# EAGLE design ACCUM-SIGNAL (EAGLE 9.4.0)
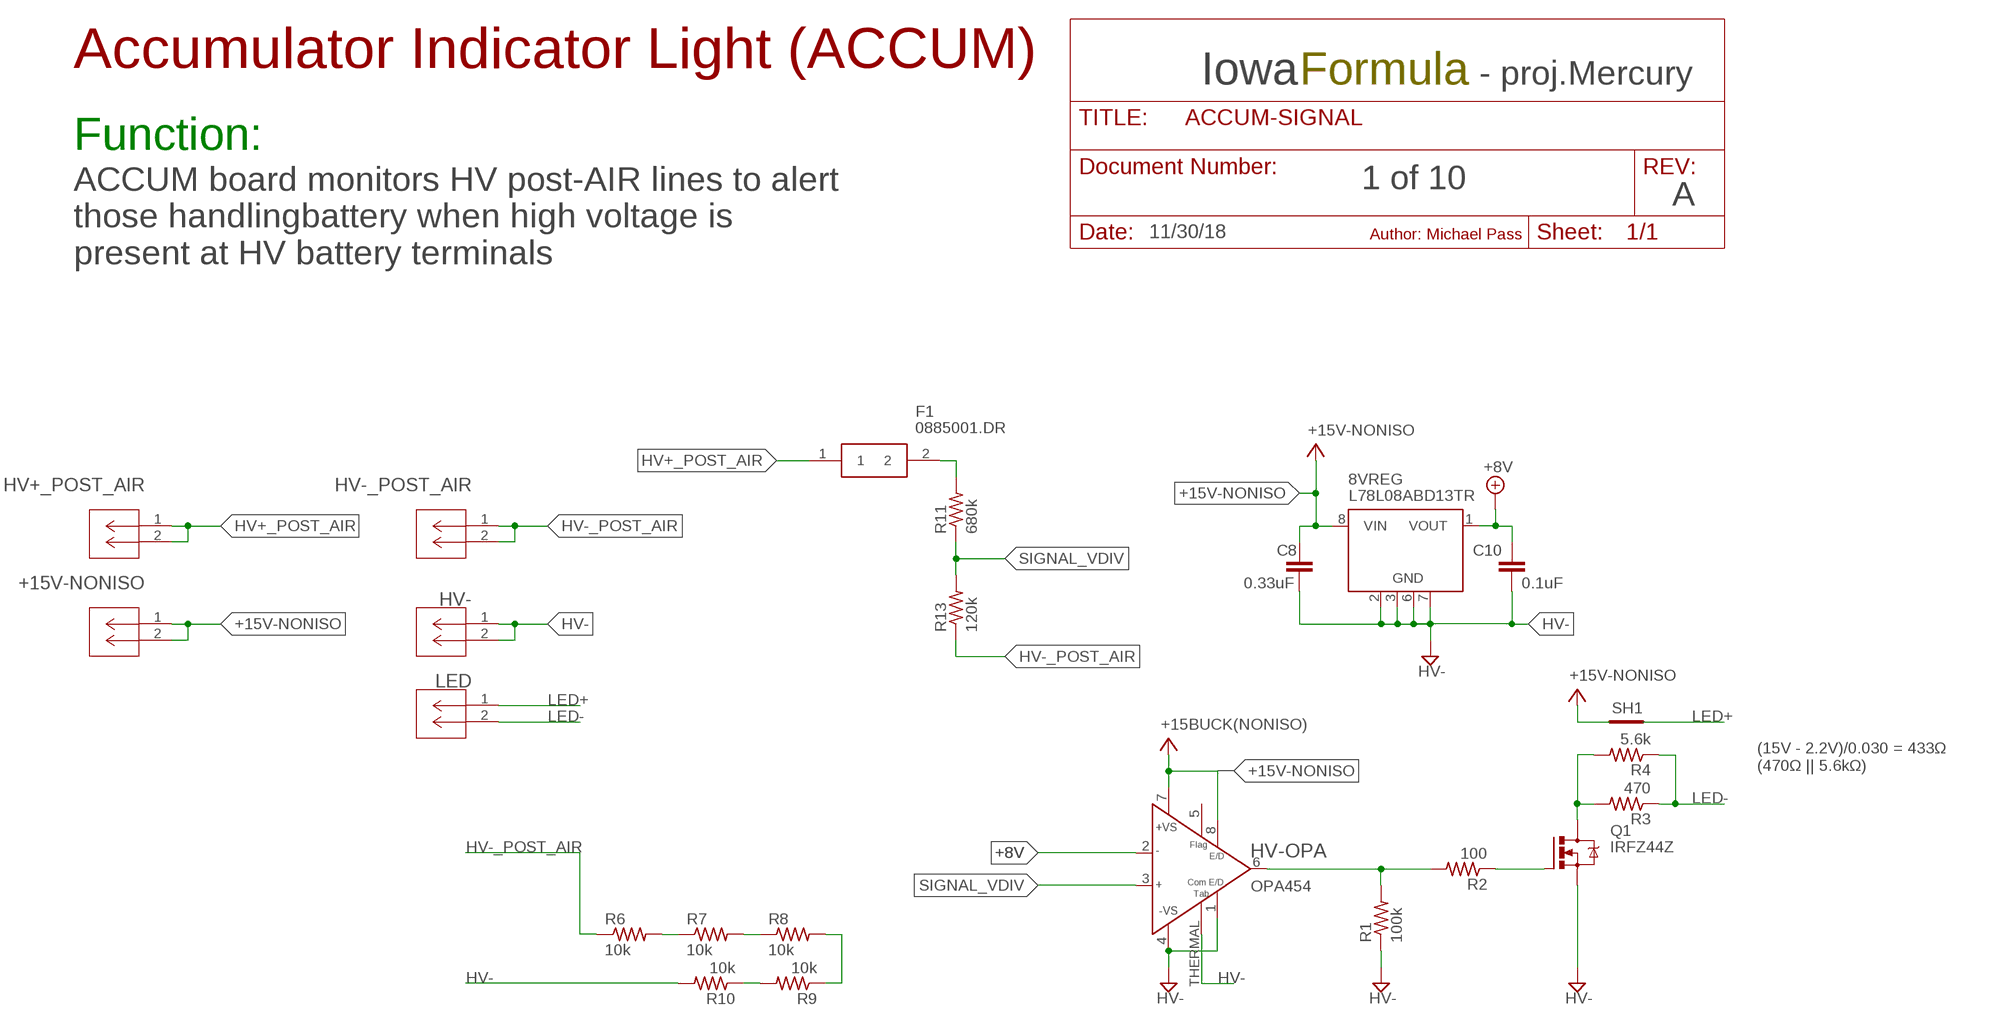
[diagram p0: schematic, sheet 1]

## Parts
8VREG  L78L08ABD13TR  78L08SMD  [SO08]
+15V-NONISO  2P(90DEG)_1-770966-0  [CON2_1X2_P163_RAMNL]
C8  0.33uF  C-EUC0805  [C0805]
C10  0.1uF  C-EUC0805  [C0805]
F1  0885001.DR  [FUSC10948X488N]
HV+_POST_AIR  2P(90DEG)_1-770966-0  [CON2_1X2_P163_RAMNL]
HV-  2P(90DEG)_1-770966-0  [CON2_1X2_P163_RAMNL]
HV-_POST_AIR  2P(90DEG)_1-770966-0  [CON2_1X2_P163_RAMNL]
HV-OPA  OPA454  [SO08GP]
LED  2P(90DEG)_1-770966-0  [CON2_1X2_P163_RAMNL]
Q1  IRFZ44Z  IRLZ44Z  [TO220BH]
R1  100k  R-US_R0805  [R0805]
R2  100  R-US_R0805  [R0805]
R3  470  R-US_R0805  [R0805]
R4  5.6k  R-US_R0805  [R0805]
R6  10k  R-US_R0805  [R0805]
R7  10k  R-US_R0805  [R0805]
R8  10k  R-US_R0805  [R0805]
R9  10k  R-US_R0805  [R0805]
R10  10k  R-US_R0805  [R0805]
R11  680k  R-US_R0805  [R0805]
R13  120k  R-US_R0805  [R0805]
SH1  SHORTT5  [SHORT_TOP-50]

## Nets
+8V: 8VREG.1(VOUT) C10.1 HV-OPA.2(IN-)
+15V-NONISO: 8VREG.8(VIN) +15V-NONISO.1 +15V-NONISO.2 C8.1 HV-OPA.7(+VS) HV-OPA.8(E/D) SH1.1 ; supply symbol labelled +15BUCK(NONISO)
HV+_POST_AIR: F1.1 HV+_POST_AIR.1 HV+_POST_AIR.2
HV-: 8VREG.2(GND) 8VREG.3(GND) 8VREG.6(GND) 8VREG.7(GND) C8.2 C10.2 HV-.1 HV-.2 HV-OPA.1(E/DCOM) HV-OPA.4(-VS) HV-OPA.THERMAL(E/DCOM1) Q1.S R1.1 R10.2
HV-_POST_AIR: HV-_POST_AIR.1 HV-_POST_AIR.2 R6.1 R13.1
LED+: LED.1 SH1.2
LED-: LED.2 R3.1 R4.1
N$1: Q1.D R3.2 R4.2
N$2: F1.2 R11.2
N$3: Q1.G R2.1
N$4: R7.2 R8.1
N$5: R6.2 R7.1
N$7: R8.2 R9.1
N$8: R9.2 R10.1
N$9: HV-OPA.6(OUT) R1.2 R2.2
SIGNAL_VDIV: HV-OPA.3(IN+) R11.1 R13.2
Unconnected: 8VREG.4(NC) 8VREG.5(NC) HV-OPA.5(STATUS)

## Notes on the sheet
- Accumulator Indicator Light (ACCUM)
- Iowa | Formula | - proj.Mercury
- Function:
- 1 of 10
- A
- 11/30/18 | Author: Michael Pass
- ACCUM board monitors HV post-AIR lines to alert
  those handlingbattery when high voltage is 
  present at HV battery terminals
- (15V - 2.2V)/0.030 = 433Ω
  (470Ω || 5.6kΩ)

## Library data of the parts
8VREG = linear:78L*SMD: Positive VOLTAGE REGULATOR
+15V-NONISO HV+_POST_AIR HV- HV-_POST_AIR LED = con-MATE-N-LOK:2P(90DEG)_1-770966-0; MANUFACTURER_PART_NUMBER: 17709660; VENDOR: TE Connectivity
C8 C10 = rcl:C-EU: CAPACITOR, European symbol; SPICEPREFIX: C
F1 = 0885001.DR:0885001.DR: LITTELFUSE - 0885001.DR - FUSE, AEC-Q200, 1A, 500VDC, 0402 Source: Datasheet <https://m.littelfuse.com/~/media/electronics/datasheets/fuses/littelfuse_fuse_885_datasheet.pdf.pdf>; DESCRIPTION: LITTELFUSE - 0885001.DR - FUSE, AEC-Q200, 1A, 500VDC, 0402; HEIGHT: 4.88mm; MANUFACTURER_NAME: LITTELFUSE; MANUFACTURER_PART_NUMBER: 0885001.DR; MOUSER_PART_NUMBER: 576-0885001.DR; MOUSER_PRICE-STOCK: https://www.mouser.com/Search/Refine.aspx?Keyword=576-0885001.DR
HV-OPA = OPA454:OPA454: TexasInstruments High-Voltage (100V), High-Current (50mA) Operatioanl Amplifier, G = 1 Stable http://focus.ti.com/lit/ds/symlink/opa454.pdf; AVAILABILITY: Unavailable; DESCRIPTION: High Voltage _100V_ High-Current _50mA_ Operational Amplifiers G=1 Stable; MF: Texas Instruments; MP: OPA454; PACKAGE: None; PRICE: None
Q1 = transistor-power:IRLZ44Z: N-Channel HEXFET® Power MOSFET Logic Level AUTOMOTIVE MOSFET Source: http://www.irf.com/product-info/datasheets/data/irlz44zpbf.pdf
R1-R4 R6-R11 R13 = rcl:R-US_: RESISTOR, American symbol; SPICEPREFIX: R
SH1 = shorts:SHORT: Short between two nets; BOM: no

## Board
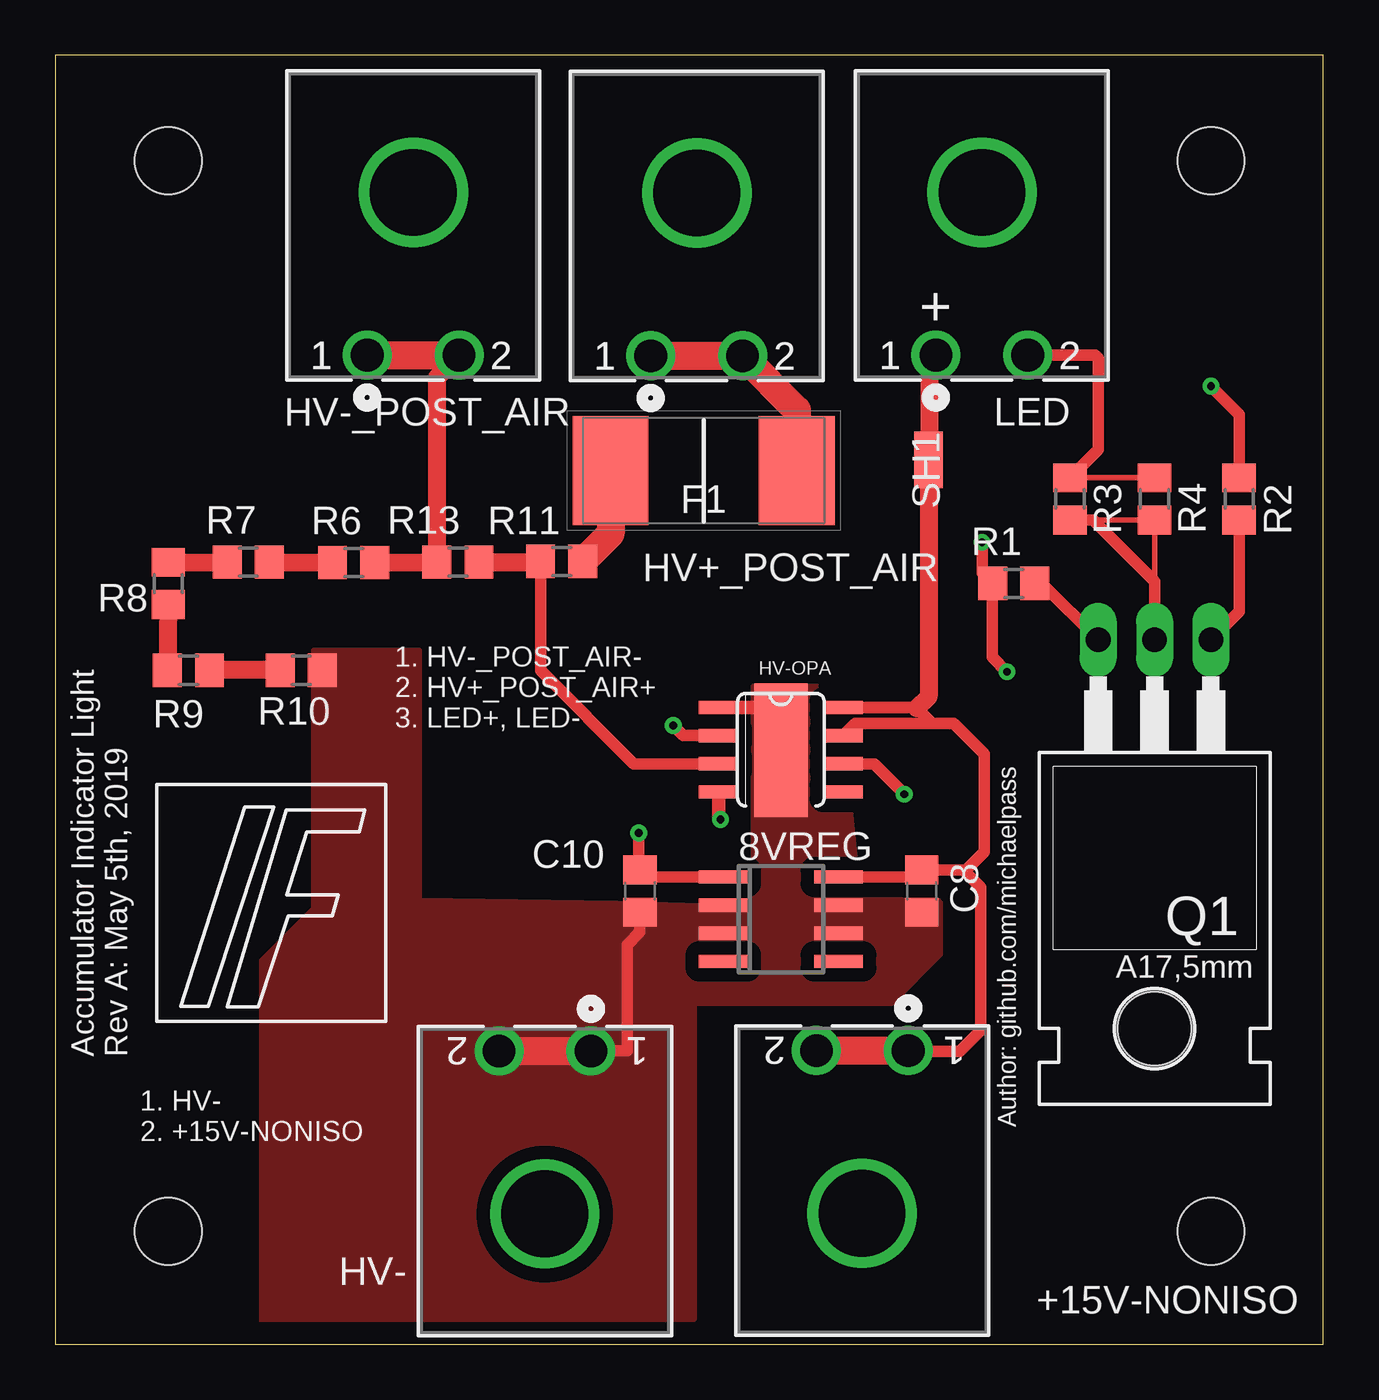
[diagram p1: board, top side]
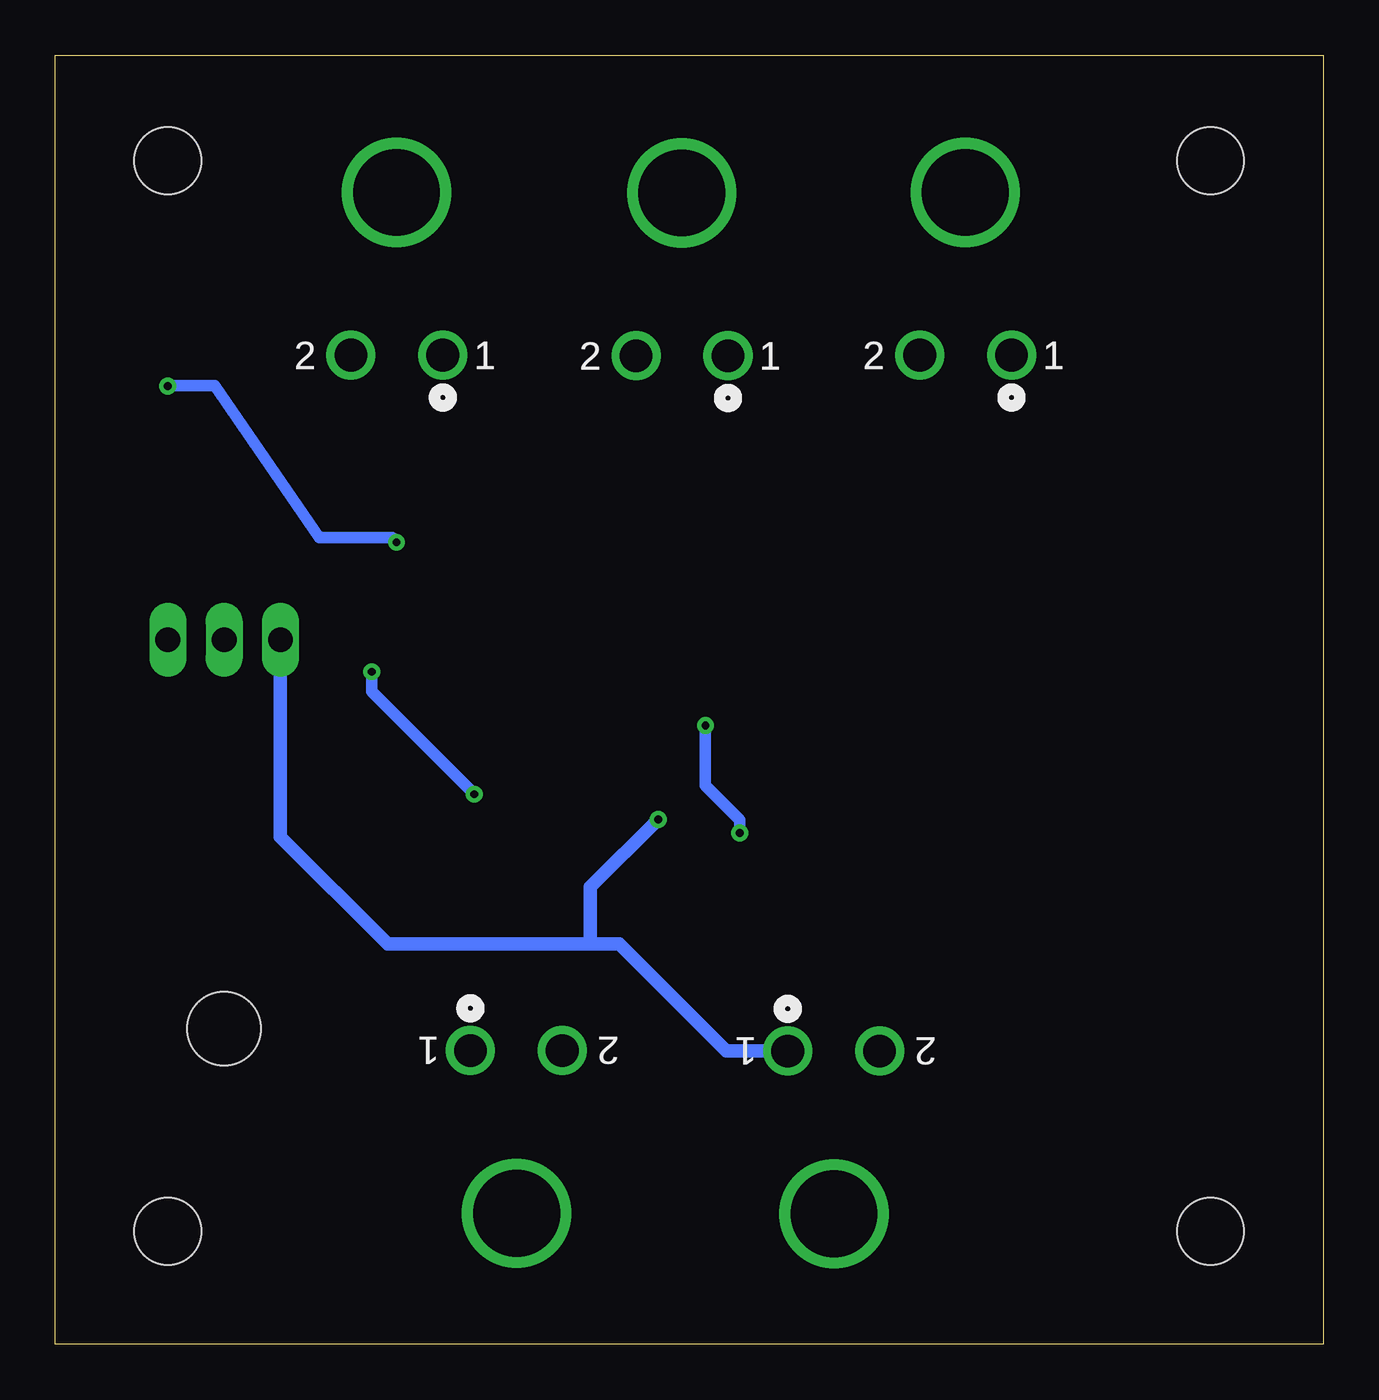
[diagram p2: board, bottom side, seen from below]

Size 57.13 x 58.09 mm. Coordinates in mm from the lower left corner, seen from the top.
Outline: 0,0 57.13,0 57.13,58.09 0,58.09 0,0
Copper layers (1*16): Top 0.035mm / dielectric 1.5mm / Bottom 0.035mm
Design rules "default": minimum track width 6mil, minimum drill 0.35mm, track to track 6mil, track to pad 6mil, pad to pad 6mil, via to via 6mil, smd to smd 6mil, copper to edge 40mil, drill to drill 6mil, minimum pad ring 10mil, minimum via ring 8mil, stop-mask expansion 4mil, vias tented up to drill 0mil, thermal gap 10mil
Holes 3 mm at 5.08,53.34 52.07,53.34 52.07,5.08 5.08,5.08

### Footprints (pad centres in the part's own frame; a part is rotated, then mirrored left to right if it is on the bottom)
SO08 = smd 0.6 x 2.2: 1 -1.905,-2.6; 2 -0.635,-2.6; 3 0.635,-2.6; 4 1.905,-2.6; 5 1.905,2.6; 6 0.635,2.6; 7 -0.635,2.6; 8 -1.905,2.6
CON2_1X2_P163_RAMNL = drill 1.473 pad 1.981: 1 -4.14,0; 2 0,0 | drill 3.912 pad 3.912: 3 -2.057,7.341
C0805 = smd 1.3 x 1.5: 1 -0.95,0; 2 0.95,0
FUSC10948X488N = smd 3.41 x 4.91: 1 -4.195,0; 2 4.195,0
SO08GP = smd 0.6 x 1.8: 1 -1.925,-2.8; 2 -0.655,-2.8; 3 0.615,-2.8; 4 1.885,-2.8; 5 1.885,2.8; 6 0.615,2.8; 7 -0.655,2.8; 8 -1.925,2.8 | smd 6 x 2.4: THERMAL 0,0
TO220BH = drill 1.118 long: D 0,-6.35; G -2.54,-6.35; S 2.54,-6.35 | hole 3.302: 0,11.176
R0805 = smd 1.3 x 1.5: 1 -0.95,0; 2 0.95,0
SHORT_TOP-50 = smd 1.27 x 1.27: 1 0.635,0; 2 -0.635,0

### Placement (x,y rotation side)
8VREG  32.69,19.15 270 top
+15V-NONISO  34.29,13.23 180 top
C8  39.04,20.42 270 top
C10  26.34,20.42 270 top
F1  29.21,39.37 180 top
HV+_POST_AIR  30.96,44.55 0 top
HV-  19.99,13.21 180 top
HV-_POST_AIR  18.19,44.58 0 top
HV-OPA  32.69,26.77 270 top
LED  43.81,44.58 0 top
Q1  49.53,25.4 180 top
R1  43.18,34.29 180 top
R2  53.34,38.1 90 top
R3  45.72,38.1 270 top
R4  49.53,38.1 270 top
R6  13.44,35.23 180 top
R7  8.69,35.26 180 top
R8  5.08,34.29 270 top
R9  5.99,30.38 0 top
R10  11.07,30.38 0 top
R11  22.81,35.28 0 top
R13  18.14,35.26 0 top
SH1  39.34,39.85 270 top

### Tracks (layer width: path | path; a pad name or v marks a point on that pad's centre or on a via)
+8V  (via drill 0.35)
  Top 0.508: 8VREG.1 26.66,21.06 C10.1 26.29,21.42 v26.29,23.04 | HV-OPA.2 28.3,27.43 v27.84,27.89
  Bottom 0.508: v27.84,27.89 27.84,25.17 26.29,23.62 v26.29,23.04
+15V-NONISO
  Top 0.508: 8VREG.8 38.73,21.06 C8.1 | +15V-NONISO.1 38.48,13.19 40.74,13.19 41.71,14.15 41.71,20.57 40.91,21.37 C8.1 | C8.1 41.05,21.37 41.86,22.18 41.86,26.59 40.48,27.97 39.52,27.97 | HV-OPA.8 38.79,28.7 38.82,28.66 39.52,27.97 | 39.52,27.97 36.04,27.97 HV-OPA.7
  Top 0.813: SH1.1 39.34,29.18 38.82,28.66
  Top 1.27: +15V-NONISO.2 +15V-NONISO.1
HV+_POST_AIR
  Top 1.27: HV+_POST_AIR.1 HV+_POST_AIR.2 33.41,42.11 F1.1
HV-  (via drill 0.35)
  Top 0.254: 29.89,23.73 v29.97,23.65
  Top 0.508: C10.2 26.34,18.58 25.76,18 25.76,13.21 HV-.1 | R1.1 44.45,34.29 Q1.S
  Top 0.61: HV-OPA.4 29.89,23.73 | HV-OPA.1 33.02,28.7 32.69,28.37 HV-OPA.THERMAL
  Top 1.27: HV-.2 HV-.1
  Bottom 0.61: Q1.S 46.99,22.86 42.16,18.03 33.02,18.03 | HV-.1 26.9,13.21 31.73,18.03 33.02,18.03 | v29.97,23.65 33.02,20.6 33.02,18.03
  pour Top (isolate 0.61, no thermals): 31.45,29.64 31.45,19.68 25.29,19.87 16.38,19.99 16.38,31.27 11.63,31.27 11.63,19.61 9.3,17.27 9.3,0.79 28.4,0.79 28.78,1.17 28.78,15.37 37.67,15.37 39.88,17.58 39.88,19.89 39.75,20.02 36.23,20.02 35.26,29.64
HV-_POST_AIR
  Top 0.813: R6.1 R13.1 17.19,43.58 HV-_POST_AIR.2
  Top 1.27: HV-_POST_AIR.1 HV-_POST_AIR.2
LED+
  Top 0.813: LED.1 39.37,44.27 39.37,40.51 SH1.2
LED-
  Top 0.254: R3.1 R4.1
  Top 0.508: R3.1 46.99,40.32 46.99,44.45 46.86,44.58 LED.2
N$1
  Top 0.254: R3.2 R4.2 49.53,33.02
  Top 0.508: R3.2 46.76,37.15 49.53,34.38 49.53,33.02 Q1.D
N$2
  Top 1.27: F1.2 25.02,36.54 R11.2
N$3
  Top 0.508: R2.1 53.34,33.02 Q1.G
N$4
  Top 0.813: R8.1 R7.2
N$5
  Top 0.813: R7.1 R6.2
N$7
  Top 0.813: R8.2 R9.1
N$8
  Top 0.813: R10.1 R9.2
N$9  (via drill 0.35)
  Top 0.508: HV-OPA.6 36.89,26.16 v38.25,24.79 | v42.88,30.3 42.2,30.97 42.2,34.31 R1.2 41.76,34.76 v41.76,36.14 | v52.07,43.18 53.34,41.91 R2.2
  Bottom 0.508: v38.25,24.79 42.88,29.41 v42.88,30.3 | v52.07,43.18 52.05,43.2 49.96,43.2 45.24,36.35 41.96,36.35 v41.76,36.14
SIGNAL_VDIV
  Top 0.508: R11.1 21.86,30.36 26.06,26.16 HV-OPA.3
  Top 0.813: R13.2 21.83,35.26 R11.1

### Text on the board
tPlace: +
tNames: 1. HV-_POST_AIR- / 2. HV+_POST_AIR+ / 3. LED+, LED- | Accumulator Indicator Light / Rev A: May 5th, 2019 | Author: github.com/michaelpass | 1. HV- / 2. +15V-NONISO